# EAGLE design tennka4 (EAGLE 6.5.0)
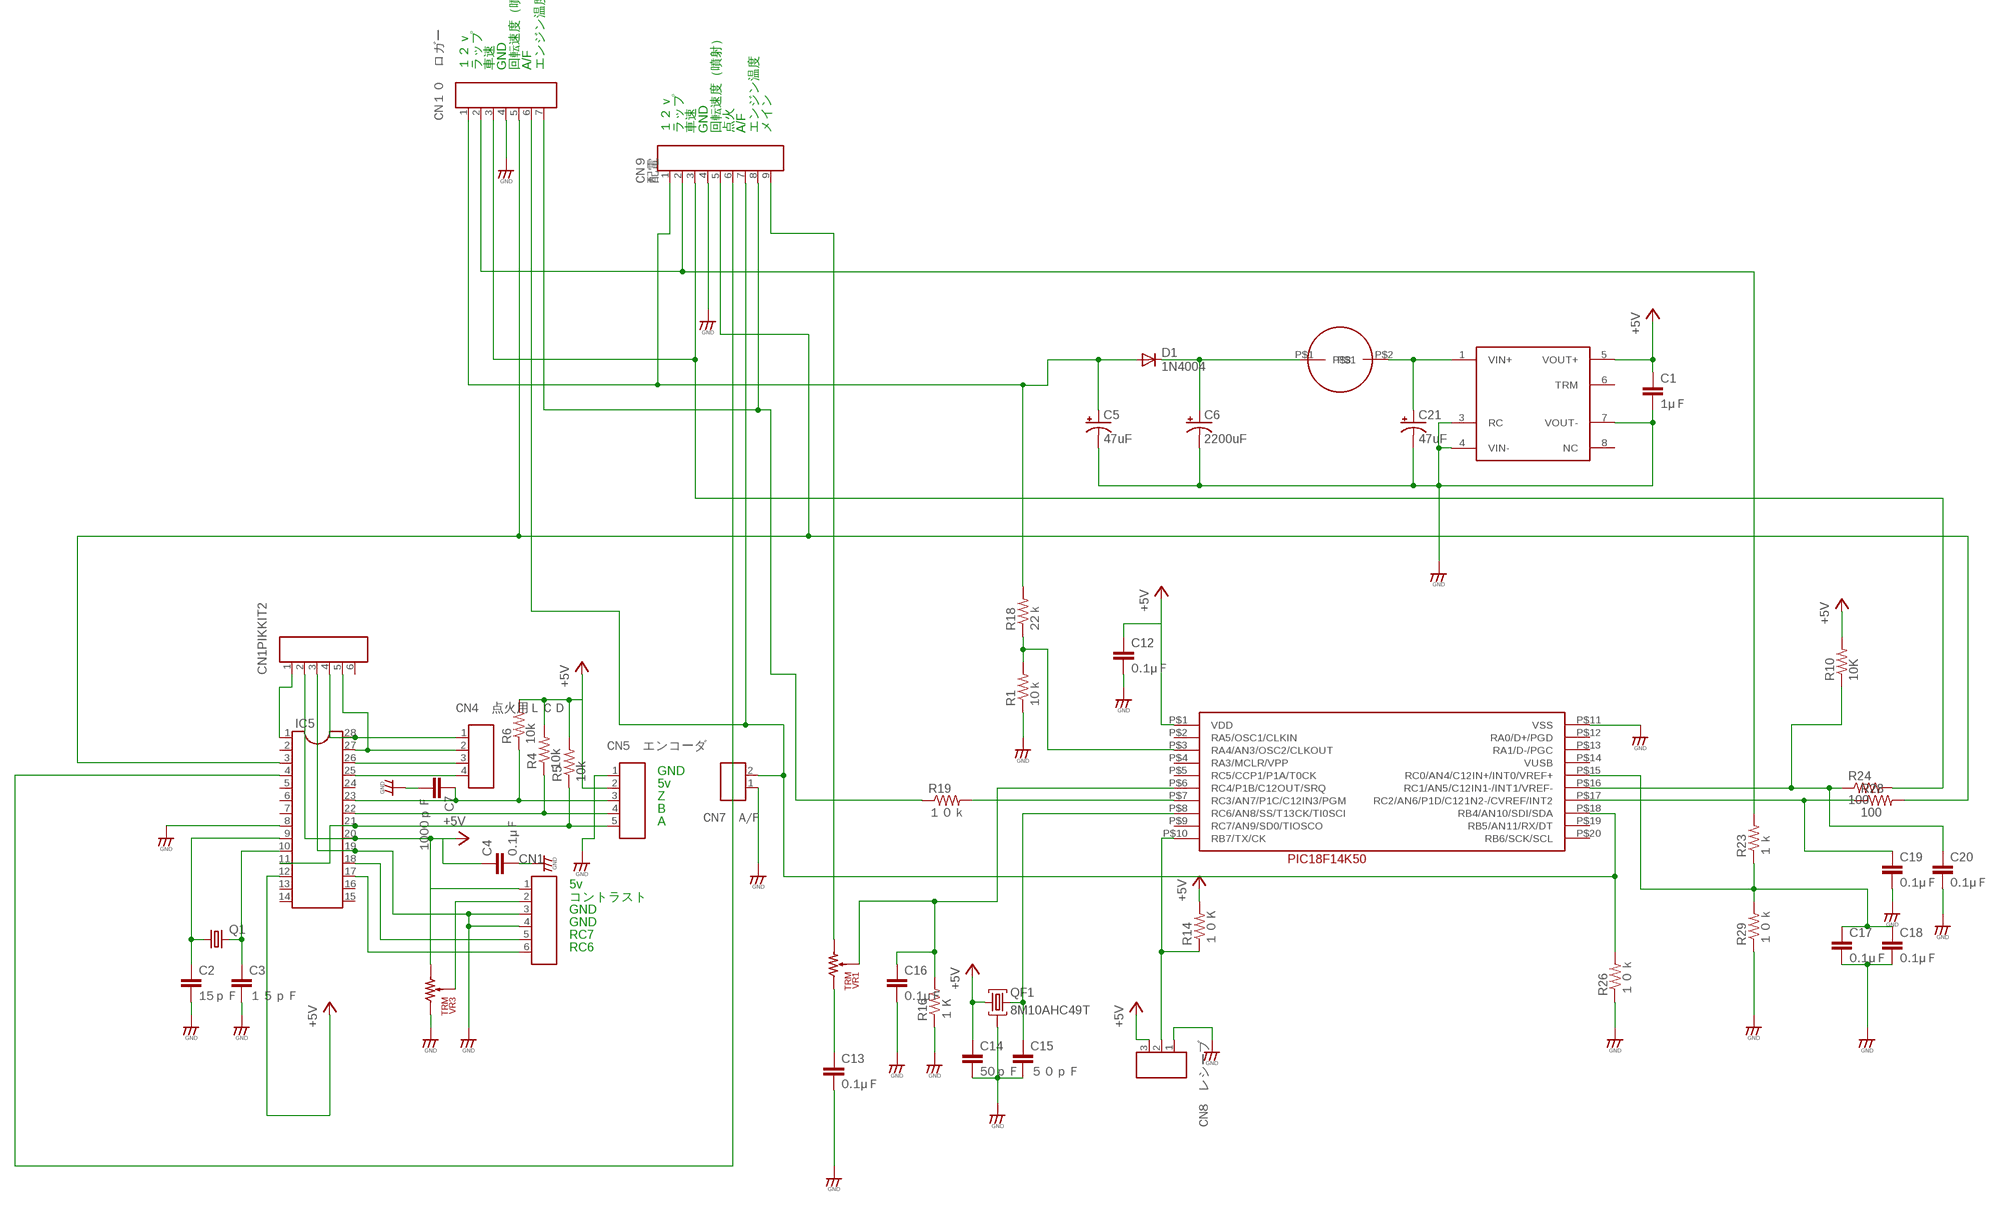
[diagram p0: schematic, sheet 1]

## Parts
C1  1μＦ  C-EU025-024X044  [C025-024X044]
C2  15ｐＦ  C-EU025-024X044  [C025-024X044]
C3  １５ｐＦ  C-EU025-024X044  [C025-024X044]
C4  0.1μＦ  C-EU025-024X044  [C025-024X044]
C5  47uF  CPOL-USE2-4  [E2-4]
C6  2200uF  CPOL-USE5-13  [E5-13]
C7  1000ｐＦ  C-EU025-024X044  [C025-024X044]
C12  0.1μＦ  C-EU025-024X044  [C025-024X044]
C13  0.1μＦ  C-EU025-024X044  [C025-024X044]
C14  50ｐＦ  C-EU025-024X044  [C025-024X044]
C15  ５０ｐＦ  C-EU025-024X044  [C025-024X044]
C16  0.1μＦ  C-EU025-024X044  [C025-024X044]
C17  0.1μＦ  C-EU025-024X044  [C025-024X044]
C18  0.1μＦ  C-EU025-024X044  [C025-024X044]
C19  0.1μＦ  C-EU025-024X044  [C025-024X044]
C20  0.1μＦ  C-EU025-024X044  [C025-024X044]
C21  47uF  CPOL-USE2-4  [E2-4]
CN1  CON_6P  [CON_HRS_DIP_6]
CN1PIKKIT2  CON_6P  [CON_HRS_DIP_6]
CN4　点火用ＬＣＤ  CON_4P  [CON_HRS_DIP_4]
CN5　エンコーダ  CON_5P  [CON_HRS_DIP_5]
CN7　A/F  CON_2P  [CON_HRS_DIP_2]
CN8　レシーブ  CON_3P  [CON_HRS_DIP_3]
CN１０　ロガー  CON_7P  [CON_HRS_DIP_7]
CN９  配電  CON_9P  [CON_HRS_DIP_9]
D1  1N4004  [DO41-10]
IC5  DIL28-3  [DIL28-3]
IC6  PIC18F14K50  [PIC18F14K50]
Q1  CRYSTALHC49S  [HC49/S]
QF1  8M10AHC49T  [HC49U]
R1  10ｋ  R-US_0207/7  [0207/7]
R4  10k  R-US_0207/7  [0207/7]
R5  10k  R-US_0207/7  [0207/7]
R6  10k  R-US_0207/7  [0207/7]
R10  10K  R-US_0207/7  [0207/7]
R14  １０Ｋ  R-US_0207/7  [0207/7]
R16  １Ｋ  R-US_0207/7  [0207/7]
R18  22ｋ  R-US_0207/7  [0207/7]
R19  １０ｋ  R-US_0207/7  [0207/7]
R23  １ｋ  R-US_0207/7  [0207/7]
R24  100  R-US_0207/7  [0207/7]
R26  １０ｋ  R-US_0207/7  [0207/7]
R28  100  R-US_0207/7  [0207/7]
R29  １０ｋ  R-US_0207/7  [0207/7]
U$3  DCDC-CC3-1205SF-E  [DCDC-CC3-1205SF-E]
VR1  TRM  [TRM]
VR3  TRM  [TRM]
リアクトル  INBATERBP  [INBATER101YG]

## Nets
1K: C13.1 VR1.P$3
+5V: C1.1 C4.1 C12.1 C14.1 CN1.1 CN1PIKKIT2.2 CN5　エンコーダ.2 CN8　レシーブ.3 IC5.12 IC5.20 IC6.P$1(VDD) QF1.1 R4.2 R5.2 R6.2 R10.2 R14.2 U$3.5(VOUT+) VR3.P$1
GND: C1.2 C2.2 C3.2 C4.2 C5.- C6.- C7.2 C12.2 C13.2 C14.2 C15.2 C16.2 C17.2 C18.2 C19.2 C20.2 C21.- CN1.3 CN1.4 CN1PIKKIT2.3 CN5　エンコーダ.1 CN7　A/F.1 CN8　レシーブ.1 CN１０　ロガー.4 CN９.4 IC5.8 IC5.19 IC6.P$11(VSS) QF1.2 R1.1 R16.1 R26.1 R29.1 U$3.3(RC) U$3.4(VIN-) U$3.7(VOUT-) VR3.P$3
N$1: CN１０　ロガー.7 CN９.8 R19.1
N$2: CN1PIKKIT2.1 IC5.1
N$5: CN1PIKKIT2.4 CN4　点火用ＬＣＤ.1 IC5.28
N$6: CN1PIKKIT2.5 CN4　点火用ＬＣＤ.2 IC5.27
N$7: CN4　点火用ＬＣＤ.3 IC5.26
N$8: CN4　点火用ＬＣＤ.4 IC5.25
N$9: CN1.2 VR3.P$2
N$10: CN1.6 IC5.17
N$11: CN１０　ロガー.5 CN９.5 IC5.3 R28.2
N$15: CN９.6 IC5.4
N$17: C21.+ U$3.1(VIN+) リアクトル.P$2
N$18: CN１０　ロガー.3 CN９.3 R24.2
N$22: C2.1 IC5.9 Q1.1
N$23: C3.1 IC5.10 Q1.2
N$24: C19.1 IC6.P$17(RC2/AN6/P1D/C121N2-/CVREF/INT2) R28.1
N$25: C6.+ D1.C リアクトル.P$1
N$28: C7.1 CN5　エンコーダ.3 IC5.23 R6.1
N$29: CN5　エンコーダ.4 IC5.22 R4.1
N$30: CN5　エンコーダ.5 IC5.11 IC5.21 R5.1
N$31: CN8　レシーブ.2 IC6.P$10(RB7/TX/CK) R14.1
N$34: IC6.P$7(RC3/AN7/P1C/C12IN3/PGM) R19.2
N$35: C15.1 IC6.P$8(RC6/AN8/SS/T13CK/TI0SCI) QF1.3
N$40: C16.1 IC6.P$6(RC4/P1B/C12OUT/SRQ) R16.2 VR1.P$2
N$41: CN1.5 IC5.18
N$44: CN7　A/F.2 CN１０　ロガー.6 CN９.7 IC6.P$18(RB4/AN10/SDI/SDA) R26.2
N$45: C17.1 C18.1 IC6.P$15(RC0/AN4/C12IN+/INT0/VREF+) R23.1 R29.2
N$47: CN１０　ロガー.2 CN９.2 R23.2
N$49: C20.1 IC6.P$16(RC1/AN5/C12IN1-/INT1/VREF-) R10.1 R24.1
N$50: CN９.9 VR1.P$1
N$52: IC6.P$3(RA4/AN3/OSC2/CLKOUT) R1.2 R18.1
N$72: C5.+ CN１０　ロガー.1 CN９.1 D1.A R18.2
Unconnected: CN1PIKKIT2.6 IC5.2 IC5.5 IC5.6 IC5.7 IC5.13 IC5.14 IC5.15 IC5.16 IC5.24 IC6.P$2(RA5/OSC1/CLKIN) IC6.P$5(RC5/CCP1/P1A/T0CK) IC6.P$9(RC7/AN9/SD0/TIOSCO) IC6.P$12(RA0/D+/PGD) IC6.P$13(RA1/D-/PGC) IC6.P$14(VUSB) IC6.P$19(RB5/AN11/RX/DT) IC6.P$20(RB6/SCK/SCL) U$3.6(TRM) U$3.8(NC)

## Notes on the sheet
- １２ｖ | ラップ | 車速 | GND | 回転速度（噴射） | A/F | エンジン温度
- １２ｖ | ラップ | 車速 | GND | 回転速度（噴射） | 点火 | A/F | エンジン温度 | メイン
- GND
- 5v
- Z
- B
- A
- 5v
- コントラスト
- GND
- GND
- RC7
- RC6

## Power pins joined to a net without a drawn wire
RA3/MCLR/VPP: IC6.P$4(RA3/MCLR/VPP)

## Library data of the parts
C1-C4 C7 C12-C20 = rcl:C-EU: CAPACITOR, European symbol
C5 C6 C21 = rcl:CPOL-US: POLARIZED CAPACITOR, American symbol
CN1 CN1PIKKIT2 = da_parts:CON_6P
CN4　点火用ＬＣＤ = da_parts:CON_4P
CN5　エンコーダ = da_parts:CON_5P
CN7　A/F = da_parts:CON_2P
CN8　レシーブ = da_parts:CON_3P
CN１０　ロガー = da_parts:CON_7P
CN９ = da_parts:CON_9P
D1 = diode:1N4004: DIODE general purpose rectifier, 1 A
IC5 = ic-package:DIL28: Dual In Line
IC6 = pic18f14k50:PIC18F14K50
Q1 = crystal:CRYSTAL: CRYSTAL; OC_FARNELL: 1667008; OC_NEWARK: unknown
QF1 = crystal:8M10AHC49T: Monolithic Crystal Filters Source: www.vanlong.com; OC_FARNELL: unknown; OC_NEWARK: unknown
R1 R4-R6 R10 R14 R16 R18 R19 R23 R24 R26 R28 R29 = rcl:R-US_: RESISTOR, American symbol
U$3 = DCDC:DCDC-CC3-1205SF-E: DCDC-CC3-1205SF-E
VR1 VR3 = kitpcb:TRM
リアクトル = Inbater:INBATER: Inbater 101 Yg

## Board
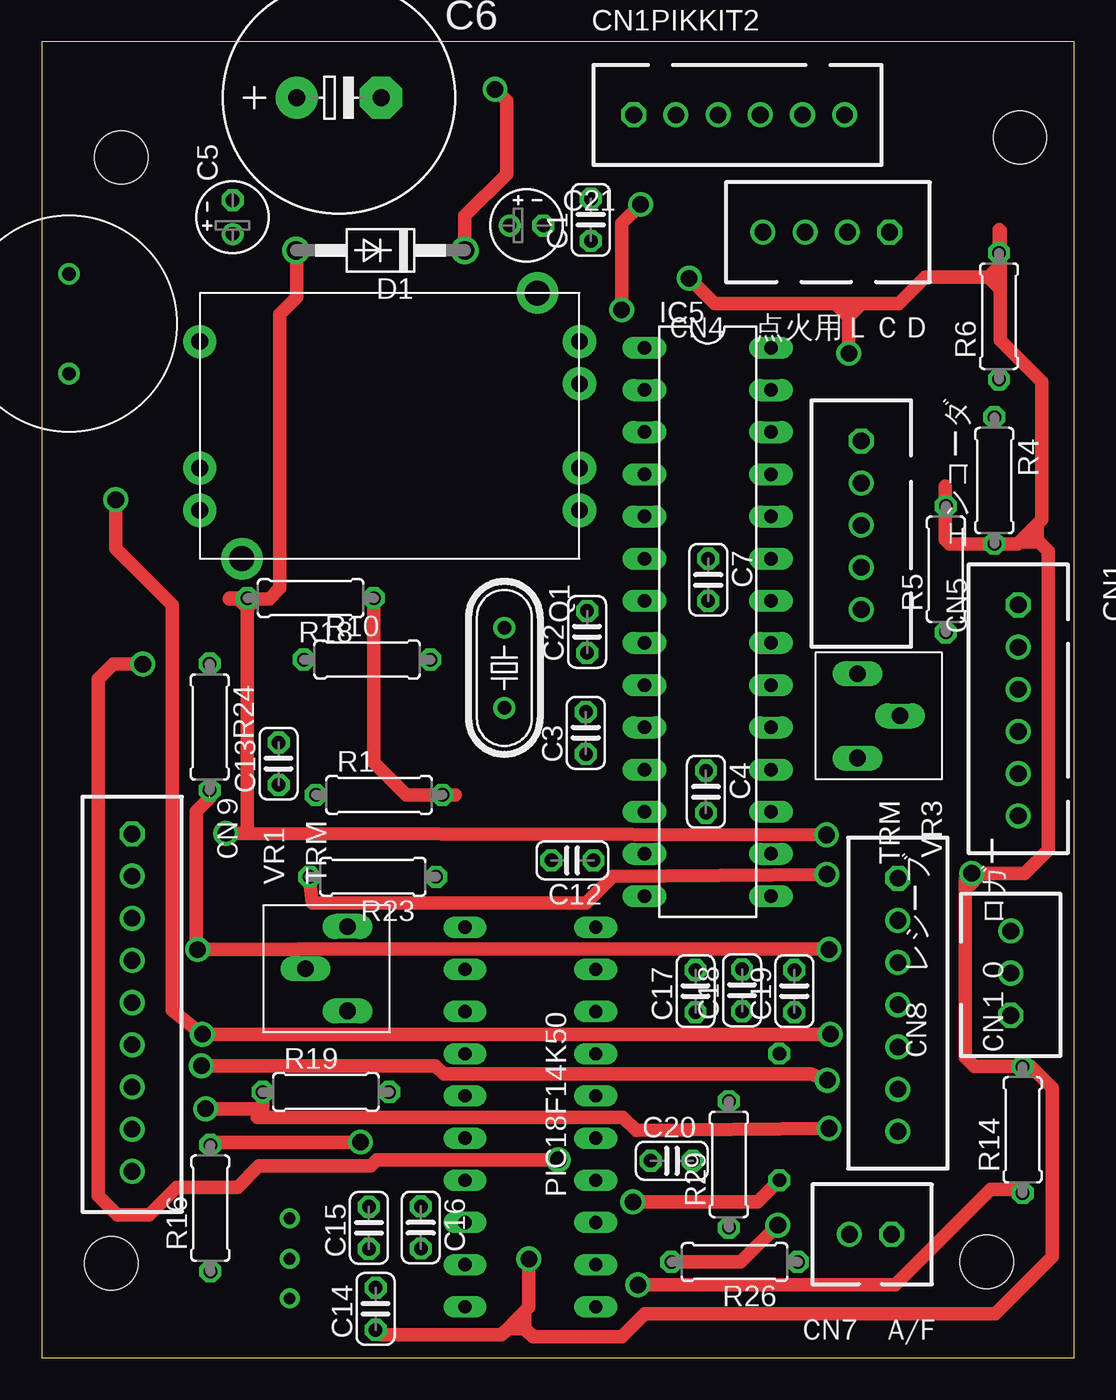
[diagram p1: board, top side]
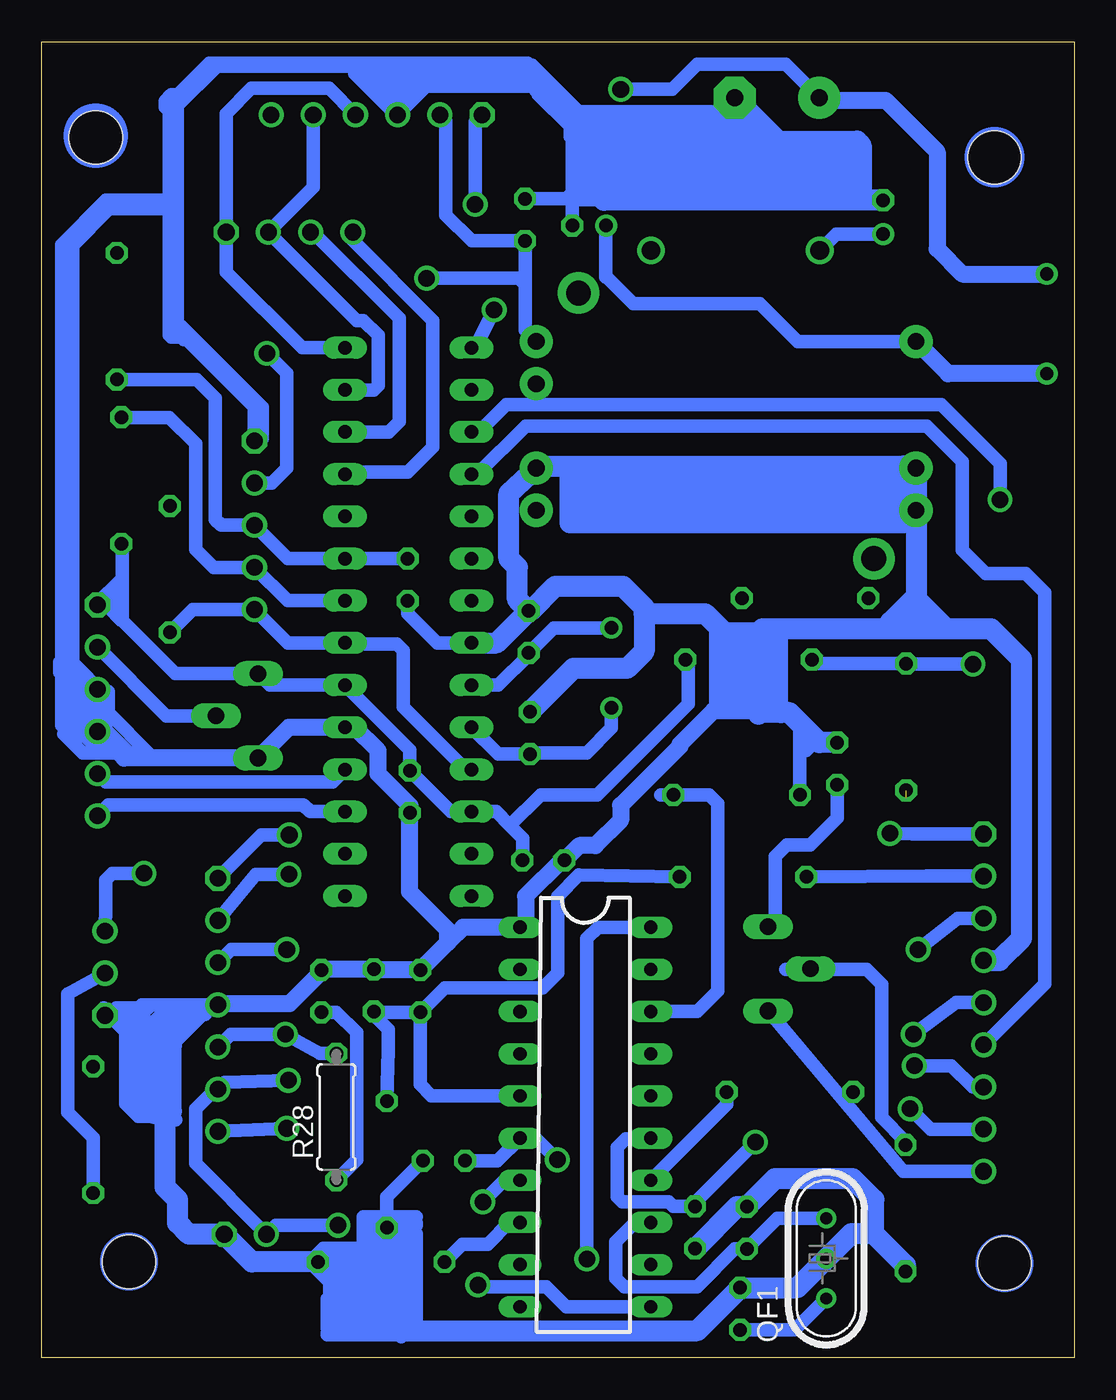
[diagram p2: board, bottom side, seen from below]

Size 62.17 x 79.28 mm. Coordinates in mm from the lower left corner, seen from the top.
Outline: 0,0 62.17,0 62.17,79.28 0,79.28 0,0
Copper layers (1*16): Top 0.035mm / dielectric 1.5mm / Bottom 0.035mm
Design rules "default": minimum track width 10mil, minimum drill 24mil, track to track 8mil, track to pad 8mil, pad to pad 8mil, via to via 8mil, smd to smd 8mil, copper to edge 40mil, drill to drill 8mil, minimum pad ring 10mil, minimum via ring 8mil, stop-mask expansion 4mil, vias tented up to drill 0mil, thermal gap 10mil
Holes 3.2 mm at 4.8,72.3 4.2,5.7 58.9,73.5 56.9,5.8

### Footprints (pad centres in the part's own frame; a part is rotated, then mirrored left to right if it is on the bottom)
C025-024X044 = drill 0.813 octagon: 1 -1.27,0; 2 1.27,0
E2-4 = drill 0.813 pad 1.27: + -1.016,0 | drill 0.813 pad 1.27 octagon: - 1.016,0
E5-13 = drill 1.016 pad 2.54: + -2.54,0 | drill 1.016 pad 2.54 octagon: - 2.54,0
CON_HRS_DIP_6 = drill 1 octagon: 1 -6.35,0 | drill 1: 2 -3.81,0; 3 -1.27,0; 4 1.27,0; 5 3.81,0; 6 6.35,0
CON_HRS_DIP_4 = drill 1 octagon: 1 -3.81,0 | drill 1: 2 -1.27,0; 3 1.27,0; 4 3.81,0
CON_HRS_DIP_5 = drill 1 octagon: 1 -5.08,0 | drill 1: 2 -2.54,0; 3 0,0; 4 2.54,0; 5 5.08,0
CON_HRS_DIP_2 = drill 1 octagon: 1 -1.27,0 | drill 1: 2 1.27,0
CON_HRS_DIP_3 = drill 1 octagon: 1 -2.54,0 | drill 1: 2 0,0; 3 2.54,0
CON_HRS_DIP_7 = drill 1 octagon: 1 -7.62,0 | drill 1: 2 -5.08,0; 3 -2.54,0; 4 0,0; 5 2.54,0; 6 5.08,0; 7 7.62,0
CON_HRS_DIP_9 = drill 1 octagon: 1 -10.16,0 | drill 1: 2 -7.62,0; 3 -5.08,0; 4 -2.54,0; 5 0,0; 6 2.54,0; 7 5.08,0; 8 7.62,0; 9 10.16,0
DO41-10 = drill 1.118: A 5.08,0; C -5.08,0
DIL28-3 = drill 0.813 long: 1 -16.51,-3.81; 2 -13.97,-3.81; 3 -11.43,-3.81; 4 -8.89,-3.81; 5 -6.35,-3.81; 6 -3.81,-3.81; 7 -1.27,-3.81; 8 1.27,-3.81; 9 3.81,-3.81; 10 6.35,-3.81; 11 8.89,-3.81; 12 11.43,-3.81; 13 13.97,-3.81; 14 16.51,-3.81; 15 16.51,3.81; 16 13.97,3.81; 17 11.43,3.81; 18 8.89,3.81; 19 6.35,3.81; 20 3.81,3.81; 21 1.27,3.81; 22 -1.27,3.81; 23 -3.81,3.81; 24 -6.35,3.81; 25 -8.89,3.81; 26 -11.43,3.81; 27 -13.97,3.81; 28 -16.51,3.81
PIC18F14K50 = drill 0.8 long: P$1 -5.08,10.16; P$2 -5.08,7.62; P$3 -5.08,5.08; P$4 -5.08,2.54; P$5 -5.08,0; P$6 -5.08,-2.54; P$7 -5.08,-5.08; P$8 -5.08,-7.62; P$9 -5.08,-10.16; P$10 -5.08,-12.7; P$11 2.794,10.16; P$12 2.794,7.62; P$13 2.794,5.08; P$14 2.794,2.54; P$15 2.794,0; P$16 2.794,-2.54; P$17 2.794,-5.08; P$18 2.794,-7.62; P$19 2.794,-10.16; P$20 2.794,-12.7
HC49/S = drill 0.813: 1 -2.413,0; 2 2.413,0
HC49U = drill 0.7 pad 1.2: 1 -2.413,0; 2 -0.027,0; 3 2.413,0
0207/7 = drill 0.813 octagon: 1 -3.81,0; 2 3.81,0
DCDC-CC3-1205SF-E = drill 1 pad 2: 1 0,13.08; 3 0,5.46; 4 0,2.92; 5 22.86,13.08; 6 22.86,10.54; 7 22.86,5.46; 8 22.86,2.92 | drill 1.5 pad 2.5: P$1 2.54,0; P$2 20.32,16.002
TRM = drill 1 long: P$1 0,0; P$2 2.54,2.54; P$3 5.08,0
INBATER101YG = drill 0.8: P$1 0,0; P$2 6,0

### Placement (x,y rotation side)
C1  33.06,68.54 90 top
C2  32.84,43.73 90 top
C3  32.77,37.64 90 top
C4  40,34.1 270 top
C5  11.5,68.7 90 top
C6  17.9,75.9 0 top
C7  40.13,46.86 270 top
C12  31.96,29.97 180 top
C13  14.27,35.79 90 top
C14  20.11,2.96 90 top
C15  19.71,7.84 90 top
C16  22.83,7.86 270 top
C17  39.37,22.09 90 top
C18  42.17,22.14 90 top
C19  45.32,22.09 90 top
C20  37.94,11.88 0 top
C21  29.2,68.2 0 top
CN1  58.8,39 270 top
CN1PIKKIT2  42,74.86 0 top
CN4　点火用ＬＣＤ  47.24,67.8 180 top
CN5　エンコーダ  49.35,50.15 270 top
CN7　A/F  49.9,7.45 180 top
CN8　レシーブ  58.35,23.17 90 top
CN１０　ロガー  51.55,21.27 270 top
CN９  5.45,21.4 270 top
D1  20.4,66.7 180 top
IC5  40.1,44.33 270 top
IC6  30.57,15.78 0 top
Q1  27.86,41.56 270 top
QF1  14.93,6 90 bottom
R1  20.32,33.91 0 top
R4  57.36,52.84 270 top
R5  54.44,47.5 90 top
R6  57.64,62.74 90 top
R10  19.6,42.06 0 top
R14  59.06,13.74 90 top
R16  10.16,9.02 90 top
R18  16.2,45.76 180 top
R19  17.12,16.02 0 top
R23  19.94,28.98 180 top
R24  10.12,38 270 top
R26  41.72,5.78 180 top
R28  44.42,14.52 90 bottom
R29  41.38,11.66 90 top
U$3  9.53,48.13 0 top
VR1  18.43,20.9 90 top
VR3  49.13,41.21 270 top
リアクトル  1.65,65.28 270 top

### Tracks (layer width: path | path; a pad name or v marks a point on that pad's centre or on a via)
1K
  Bottom 0.813: C13.1 14.27,32.53 15.9,30.9 17.3,30.9 18,30.2 18,26.41 VR1.P$3
+5V  (via drill 1)
  Top 0.61: 29.21,1.78 29.21,2.92 | 29.21,1.65 27.94,1.65
  Top 0.813: 59.45,49.75 58.73,49.03 R4.2 54.67,49.03 54.4,49.3 54.4,51.35 | 59.45,49.75 60.2,50.5 60.2,58.8 57.7,61.3 57.7,65.02 | 54.4,52.5 54.4,51.35 | 54.4,51.35 R5.2 | 59.45,49.75 60.6,48.6 60.6,30.6 59.19,29.19 v56,29.19 55.6,28.79 55.6,18.1 56.15,17.55 R14.2 59.54,17.55 60.83,16.26 60.83,6.1 57.4,2.67 36.32,2.67 34.92,1.27 29.59,1.27 29.21,1.65 28.57,2.29 | 48.64,63.5 51.6,63.5 53.2,65.1 57.62,65.1 57.7,65.02 | 48.64,63.5 40.51,63.5 v38.99,65.02 | v29.34,5.97 29.34,3.05 29.21,2.92 28.57,2.29 | 28.57,2.29 27.94,1.65 27.69,1.4 20.4,1.4 C14.1 | 57.7,65.02 57.7,67.9 57.66,67.94 57.66,66.57 R6.2 | v48.6,60.5 48.6,63.46 48.64,63.5
  Bottom 0.813: CN5　エンコーダ.2 48.31,52.69 47.4,53.6 47.4,59.3 v48.6,60.5 | 57.3,45.3 57.3,44.4 54.11,41.21 VR3.P$1 48.44,40.52 IC5.20 40,36.61 C4.1 37.53,32.9 IC5.12 34.8,32.9 33.97,32.07 | 57.3,45.3 57.3,48.97 R4.2 | C14.1 16.83,1.69 QF1.1 | 33.97,32.07 33.2,31.3 33.2,30 C12.1 | CN8　レシーブ.3 58.3,26.78 58.3,28.8 57.91,29.19 v56,29.19 | 57.3,45.3 57.35,45.35 CN1.1 | 33.06,64.64 C1.1 36.28,67.27 37.85,68.83 37.85,74.52 CN1PIKKIT2.2 | v38.99,65.02 33.45,65.02 33.06,64.64 | 33.97,32.07 32.13,33.91 28.7,33.91 23.24,39.37 23.24,41.89 R10.2 | IC6.P$1 28.67,25.94 29.34,25.27 v29.34,5.97 | 33.06,64.64 33.06,61.89 U$3.5
GND
  Bottom 0.813: C21.- 30.22,69.85 | 57.1,20.3 57.1,15.3 56.35,14.55 54.86,14.55 54.3,14.55 54.1,14.35 | 57.1,20.3 57.1,20.4 CN8　レシーブ.1 | 30.22,69.85 30.22,74.72 33.1,77.6 37.99,77.6 39.09,76.5 | CN5　エンコーダ.1 49.35,57.25 54,61.9 54,69.2 | 54,69.2 54,75.4 51.6,77.8 40.4,77.8 39.09,76.5 | CN１０　ロガー.4 56.13,21.27 57.1,20.3 | 54,69.2 58.1,69.2 60.3,67 60.3,41.77 CN1.3 CN1.4 | 19.1,43.9 19.1,43.69 19.1,43.56 | 19,38.78 19.1,38.88 21.83,38.88 21.93,38.78 | C12.2 30.83,29.97 | C1.2 30.25,69.81 30.22,69.85 | CN1PIKKIT2.3 39.09,76.5 | 25.9,44.83 25.9,45.2 | C4.2 40,33.27 | 18.29,43.81 18.29,39.5 17.65,38.86 17.65,43.56 | R26.1 43.45,5.78 R29.1 | R29.1 41.38,9.71 C20.2 | R29.1 40.85,8.38 40.85,2.49 40.01,1.65 | C7.2 40.13,44.83 38.35,43.05 IC5.8 | R1.1 16.51,36.7 16.51,36.96 | 16.51,36.96 15.88,37.59 | 16.26,36.58 16.13,36.58 15.49,37.21 | 16.51,36.96 16.51,38.1 16.89,38.48
  Bottom 1.016: 30.83,29.97 30.86,29.97 33.02,27.81 33.02,26.28 IC6.P$11 36.79,25.94 37.72,25.02 | 37.72,25.02 C17.2 42.12,23.36 C18.2 45.27,23.41 C19.2 45.32,23.26 47.24,21.34 51.48,21.34 CN１０　ロガー.4 | 37.72,25.02 37.72,25.78 40.01,28.07 C4.2 | 21.93,38.78 23.75,36.96 23.75,36.83 27.3,33.27 27.3,32.38 28.83,30.86 29.8,30.86 C12.2 | 40,33.27 41.91,35.18 41.91,36.58 43.31,37.97 IC5.19 47.28,37.98 VR3.P$3 57.2,36.13 CN1.4
  Bottom 1.27: C5.- 28.31,69.72 28.57,69.98 | 28.57,69.98 28.57,70.99 12.83,70.99 12.83,71.63 13.34,72.14 28.32,72.14 28.57,71.88 28.57,73.28 13.08,73.28 12.83,73.03 12.83,70.36 14.9,70.36 C6.- | 28.57,69.98 30.09,69.98 30.22,69.85 | 9.27,43.9 5,43.9 3.17,42.08 3.17,25.27 4.51,23.94 CN９.4 | 9.27,43.9 9.78,43.9 | 9.78,43.9 18.76,43.9 19.1,43.56 19.1,38.88 | C13.2 15.34,37.06 15.49,37.21 15.88,37.59 17.14,38.86 17.65,38.86 18.92,38.86 19,38.78 | 19.1,43.69 21.08,43.69 22.23,44.83 25.9,44.83 25.9,42.56 26.92,41.53 30.15,41.53 C3.2 | C2.2 32.73,44.99 31.24,46.48 27.18,46.48 25.9,45.2 | IC5.8 34.77,43.06 C2.2 | C2.2 33.53,45.68 33.53,47.62 34.04,48.13 34.04,52.07 U$3.7 | R16.1 10.16,5.59 12.06,7.49 | 12.06,7.49 12.06,9.53 13.34,10.79 18.02,10.79 C15.2 20.31,9.11 C16.2 | 12.06,7.49 13.41,7.49 QF1.2 16.67,4.23 C14.2 22.69,1.65 40.01,1.65 | R26.1 49.5,5.78 CN7　A/F.1 53.3,7.45 53.98,8.13 53.98,9.53 54.74,10.29 54.74,14.42 54.86,14.55 | 9.65,44.03 9.78,43.9 | U$3.3 U$3.4 9.53,45.72 | 9.53,45.72 9.53,45.47 | 9.53,45.47 9.53,44.15 9.27,43.9 | 9.53,45.47 9.27,45.47 8,44.2 | 9.53,45.72 9.65,45.72 11.05,44.32
N$1  (via drill 1)
  Top 0.813: v47.41,13.83 35.8,13.7 35,14.5 13,14.5 13.31,14.81 13.31,14.99 | R19.1 13.31,14.99 | v9.88,15.01 13.29,15.01 13.31,14.99
  Bottom 0.813: CN１０　ロガー.7 48.07,13.8 v47.41,13.83 | CN９.8 8.65,13.78 v9.88,15.01
N$2  (via drill 1)
  Top 0.813: v34.92,63.12 34.92,68.33 v36.07,69.47
  Bottom 0.813: IC5.1 36.06,60.84 v34.92,63.12 | v36.07,69.47 36.07,74.44 CN1PIKKIT2.1
N$5
  Bottom 0.813: IC5.28 46.49,60.84 51.05,65.41 CN4　点火用ＬＣＤ.1 51.05,74.93 49.53,76.45 44.86,76.45 CN1PIKKIT2.4
N$6
  Bottom 0.813: CN1PIKKIT2.5 45.81,70.5 CN4　点火用ＬＣＤ.2 43.19,62.48 42.8,62.48 41.91,61.59 41.91,58.55 42.16,58.3 IC5.27
N$7
  Bottom 0.813: CN4　点火用ＬＣＤ.3 45.83,67.8 40.64,62.61 40.64,56.39 41.27,55.75 IC5.26
N$8
  Bottom 0.813: CN4　点火用ＬＣＤ.4 43.43,67.31 38.61,62.48 38.61,54.86 40.13,53.34 43.79,53.34 IC5.25
N$9
  Bottom 0.813: VR3.P$2 54.66,38.67 CN1.2
N$10
  Bottom 0.813: IC5.17 46,32.9 46.4,33.3 58.15,33.3 CN1.6
N$11  (via drill 1)
  Top 0.813: v47.49,19.5 v9.68,19.5 7.87,20.93 7.87,45.34 4.47,48.74 v4.47,51.69
  Bottom 0.813: CN９.5 7.1,21.4 v9.68,19.5 | CN１０　ロガー.5 50.78,19.5 v47.49,19.5 45.43,18.33 R28.2 | IC5.3 35.84,55.76 34.2,57.4 8,57.4 4.45,53.85 4.45,51.72 v4.47,51.69
N$15
  Bottom 0.813: IC5.4 35.93,53.22 33.02,56.13 8.89,56.13 6.73,53.98 6.73,48.64 5.33,47.24 2.92,47.24 1.78,46.1 1.78,22.54 CN９.6
N$17
  Bottom 0.813: C21.+ 28.2,68.18 28.2,65.1 28.14,65.1 26.54,63.5 18.92,63.5 16.64,61.21 9.65,61.21 U$3.1
  Bottom 1.016: リアクトル.P$2 7.59,59.28 U$3.1
N$18  (via drill 1)  (1 unrouted)
  Top 0.813: 10.12,33.72 9.3,32.9 9.3,24.7 v9.4,24.6 15.46,24.6 15.49,24.64 47.12,24.64 v47.41,24.6
  Bottom 0.813: CN９.3 7.02,26.48 v9.4,24.6 | v47.41,24.6 50.76,24.6 CN１０　ロガー.3
N$19
  Bottom 1.27: 19.3,74.04 28.45,74.04 28.57,73.91
N$22
  Bottom 0.813: Q1.1 31.32,43.97 C2.1 32.84,42.34 34.67,40.51 IC5.9
N$23
  Bottom 0.813: Q1.2 27.86,37.93 29.34,36.45 32.69,36.45 C3.1 34.68,36.37 IC5.10
N$24  (via drill 1)
  Top 0.813: v35.6,9.4 43.11,9.4 R28.1
  Bottom 0.813: C19.1 44.42,20.82 43.2,19.6 43.2,11.93 R28.1 | IC6.P$17 34.3,10.7 v35.6,9.4
N$25  (via drill 1)
  Top 0.813: D1.C 25.48,68.78 28,71.3 28,75.7 v27.3,76.4
  Bottom 0.813: 15.2,75.74 C6.+ 17.36,77.9 22.7,77.9 24.2,76.4 v27.3,76.4
  Bottom 1.016: 15.2,75.74 11.35,75.74 8.26,72.64 8.26,66.8 6.73,65.28 リアクトル.P$1
N$26
  Bottom 1.27: 29.34,74.55 29.34,70.74
N$28
  Bottom 0.813: R6.1 52.83,58.93 51.7,57.8 51.7,50.5 51.35,50.15 CN5　エンコーダ.3 47.34,48.14 IC5.23 C7.1
N$29
  Bottom 0.813: IC5.22 47.34,45.6 CN5　エンコーダ.4 51.81,47.61 52.9,48.7 52.9,55.06 54.48,56.64 R4.1
N$30
  Bottom 0.813: IC5.11 36.64,35.44 40.4,39.2 40.4,42.6 40.8,43 43.85,43 IC5.21 47.34,43.06 CN5　エンコーダ.5 53.06,45.07 R5.1
N$31  (via drill 1)
  Top 0.813: 58.79,10.2 R14.1 58.83,10.16 57.15,10.16 51.39,4.4 v35.9,4.4
  Bottom 0.813: R14.1 59.06,13.26 60.6,14.8 60.6,21.94 CN8　レシーブ.2 | IC6.P$10 30.58,3.08 31.8,4.3 35.8,4.3 v35.9,4.4
N$34
  Bottom 0.813: R19.2 20.93,15.26 IC6.P$7
N$35
  Bottom 0.813: QF1.3 17.87,8.41 C15.1 20.43,6.57 22.7,4.3 27.1,4.3 27.6,4.8 27.6,7 26.4,8.2 25.53,8.2 IC6.P$8
N$40  (via drill 1)
  Top 0.813: v19.2,13 10.33,13 R16.2
  Bottom 0.813: IC6.P$6 25.53,13.2 27,13.2 27.5,12.7 27.5,9.7 27.2,9.4 24.4,9.4 24.13,9.13 C16.1 22.83,9.37 v19.2,13 | R16.2 10.16,13.06 11.6,14.5 11.6,22.5 12.5,23.4 17.37,23.4 VR1.P$2
N$41
  Bottom 0.813: IC5.18 44.65,34.7 58.31,34.7 CN1.5
N$44  (via drill 1)
  Top 0.813: v9.63,17.6 23.7,17.6 24.2,17.1 46.3,17.1 v47.31,16.73 | R26.2 42.1,5.78 v44.32,8
  Bottom 0.813: CN９.7 6.12,16.32 7.4,17.6 v9.63,17.6 | v47.31,16.73 51.14,16.6 CN１０　ロガー.6 51.71,16.19 52.9,15 52.9,11.72 CN7　A/F.2 48.08,8 v44.32,8 | IC6.P$18 34,8.16 35.31,6.86 36.83,6.86 R26.2
N$45
  Bottom 0.813: R29.2 41.3,18.55 41.3,19.8 42.17,20.67 C18.1 42.12,20.82 C17.1 | C17.1 39.37,16.47 38.7,15.8 33.38,15.8 IC6.P$15 | R23.1 29.82,29.08 31.1,27.8 31.1,23.2 32,22.3 37.89,22.3 C17.1
N$47  (via drill 1)
  Top 0.813: v47.28,29.13 34.4,29 32.8,27.4 16.31,27.4 R23.2
  Bottom 0.813: CN９.2 8.89,29.02 R23.2 | v47.28,29.13 49.28,29.13 CN１０　ロガー.2
N$49  (via drill 1)
  Top 0.813: v31.11,11.94 20.19,11.94 19.81,11.56 13.08,11.56 11.81,10.29 8.13,10.29 6.48,8.64 4.57,8.64 3.43,9.78 3.43,40.89 4.32,41.78 v6.1,41.78
  Bottom 0.813: C20.1 34.72,11.88 IC6.P$16 32.42,13.24 v31.11,11.94 | R10.1 15.54,41.81 R24.1 10.09,41.78 v6.1,41.78
N$50
  Bottom 0.813: CN９.9 10.29,11.24 VR1.P$1
N$52
  Top 0.813: R18.1 20.01,35.87 21.97,33.91 R1.2 24.89,33.91
  Bottom 0.813: IC6.P$3 22.7,20.86 21.46,22.1 21.46,33.4 21.97,33.91 R1.2 24.89,33.91
N$53
  Bottom 0.813: 52.32,20.7 52.45,20.7 54.36,18.8
  Bottom 1.27: 56.26,20.83 56.26,15.62 55.37,14.73 55.37,19.94 54.48,20.83 54.48,14.99 54.36,14.86 54.36,18.8 54.36,19.68 53.21,20.83
N$54
  Bottom 0.813: 55.75,21.08 57.66,21.08
N$55
  Bottom 0.813: 58.42,21.08 58.42,20.95 57.02,19.56
N$56
  Bottom 0.813: 38.23,77.09 32.64,77.09 32.38,76.83 38.48,76.83 38.73,76.58 32.64,76.58 32.26,76.2 32.26,76.07 30.35,74.17 30.35,73.53 30.23,73.41 30.23,74.68 29.84,75.06 20.7,75.06 19.56,73.91
N$57
  Bottom 0.813: 41.15,77.85 39.62,77.85 | 39.62,77.85 39.12,77.34 | 39.62,77.85 32.64,77.85 29.72,74.93
N$58
  Bottom 0.813: 40.89,77.6 40.89,75.18 40.77,75.06 40.77,75.56 39.88,76.45 40.51,77.09 40.51,76.58 40.64,76.45
N$59
  Bottom 0.813: 54.48,61.59 54.48,75.44
N$60
  Bottom 0.813: 54.74,75.31 54.74,75.69 54.36,76.07 53.98,76.07 52.07,77.98 32.89,77.98 32.38,77.47
N$61
  Bottom 0.813: 19.81,43.43 19.81,39.75 20.07,39.5 20.07,42.93 20.57,43.43 20.57,39.5 20.95,39.12 20.95,43.05 21.59,43.69 21.59,39.24 21.84,38.99
N$62
  Bottom 0.813: 45.21,5.59 41.66,5.59 41.53,5.46 41.53,3.17 42.42,2.29 43.31,2.29 44.83,3.81 44.83,5.08 42.55,5.08 42.29,4.83 42.29,3.3 42.55,3.05 43.43,3.05 43.43,3.3 44.32,4.19 42.93,4.19 42.8,4.32 42.8,3.81 43.05,3.56 43.05,3.81 43.18,3.94
N$63
  Bottom 0.813: 42.67,4.7 44.58,4.7
N$64
  Bottom 0.813: 40.51,1.27 40.51,7.62 40.77,7.87 40.01,7.87 39.62,7.49 39.62,2.29 39.75,2.16 39.75,6.73 40.26,7.24
N$65
  Bottom 0.813: 41.02,75.18 41.15,75.18 43.31,77.34 41.53,77.34 41.4,77.22 41.4,76.45 41.27,76.33 41.53,76.33 42.16,76.96
N$66
  Bottom 1.27: 9.78,53.72 10.29,53.72 | 32.51,53.72 10.29,53.72 | 10.29,53.72 10.29,50.29 30.35,50.29 30.35,52.96 11.18,52.96 11.18,51.69 29.46,51.69 | 29.46,51.69 29.46,51.82 | 29.46,51.69 29.46,50.93 10.92,50.93 10.92,51.56
N$67
  Bottom 0.813: 40.01,1.78 44.96,1.78 44.96,3.56 41.4,3.56 41.4,2.29 44.83,2.29 44.83,2.67 41.53,2.67 41.53,7.11 41.91,7.11 41.91,5.21 42.29,5.21 42.29,5.71
N$68
  Bottom 0.813: 40.13,1.52 44.96,1.52 44.96,1.4 39.5,1.4
N$69
  Bottom 0.813: 39.62,8.51 42.8,8.51 42.8,6.1 42.29,6.1 42.29,8 39.62,8 39.62,8.13
N$70
  Bottom 0.813: 57.4,46.23 57.4,46.1 58.17,45.34 57.91,45.34 57.4,44.83
N$71
  Bottom 0.813: 59.05,45.47 58.8,45.47 57.4,46.86
N$72  (via drill 1)
  Top 0.813: v11.1,31.6 12.4,31.6 | 12.4,31.6 v47.25,31.5 | 12.4,31.6 12.39,31.61 R18.2 11.34,45.76 11.3,45.72 13.72,45.72 14.35,46.35 14.35,62.87 15.37,63.88 15.37,66.65 D1.A
  Bottom 0.813: CN９.1 9.74,31.56 v11.1,31.6 | v47.25,31.5 48.94,31.5 CN１０　ロガー.1 | C5.+ 14.34,67.68 D1.A
N$73
  Bottom 0.813: 58.93,45.21 58.17,45.21 57.4,44.45
N$74
  Bottom 0.813: 45.59,5.71 45.59,6.22 45.21,6.6 40.77,6.6 40.39,6.99
N$75
  Bottom 0.813: 45.85,5.59 44.7,4.45
N$76
  Bottom 0.813: 54.36,61.47 53.72,61.47 53.59,61.34
N$77
  Bottom 0.813: 48.9,55.37 48.9,57.28 53.72,62.1
N$78
  Bottom 0.813: 54.61,69.72 58.29,69.72 60.96,67.06 60.96,41.66 59.31,40.01 59.31,37.72 59.56,37.47 60.33,37.47 60.96,38.1 60.96,41.78 61.09,41.91 61.09,41.27 59.56,39.75 59.56,37.97 60.58,37.97 60.71,38.1 60.71,39.62 60.33,40.01 60.33,38.86 60.07,38.61
N$79
  Bottom 0.813: 57.53,36.45 59.69,36.45 60.83,37.59 59.69,37.59 59.05,36.96 58.67,36.96 58.29,36.58
N$80
  Bottom 0.813: 56.64,36.45 56.9,36.45 58.29,37.85 58.29,39.88 60.33,41.91
N$81
  Bottom 0.813: 58.17,40.13 58.17,38.86 55.63,36.32
N$82
  Top 0.61: 48.51,62.74 48.39,62.74 47.88,63.25
N$83
  Top 0.61: 48.64,62.61 49.4,63.37
N$84
  Top 0.61: 56.77,65.15 56.9,65.15 57.53,65.79 | 56.64,65.15 56.77,65.15 | 56.77,65.15 57.66,64.26
N$85
  Top 0.61: 58.8,49.02 60.07,49.02 60.07,50.42 60.2,50.55
N$86
  Top 0.61: 56.77,29.08 56.64,29.08 55.75,28.19
N$87
  Top 0.61: 13.08,45.59 12.95,45.59 12.45,45.09
N$88
  Top 0.61: 12.45,44.83 12.45,44.96 11.81,45.59
(copper drawn outside any net)
  shapes: Bottom circle x4